# EAGLE schematic PETDOG-2 (EAGLE 7.5.0)
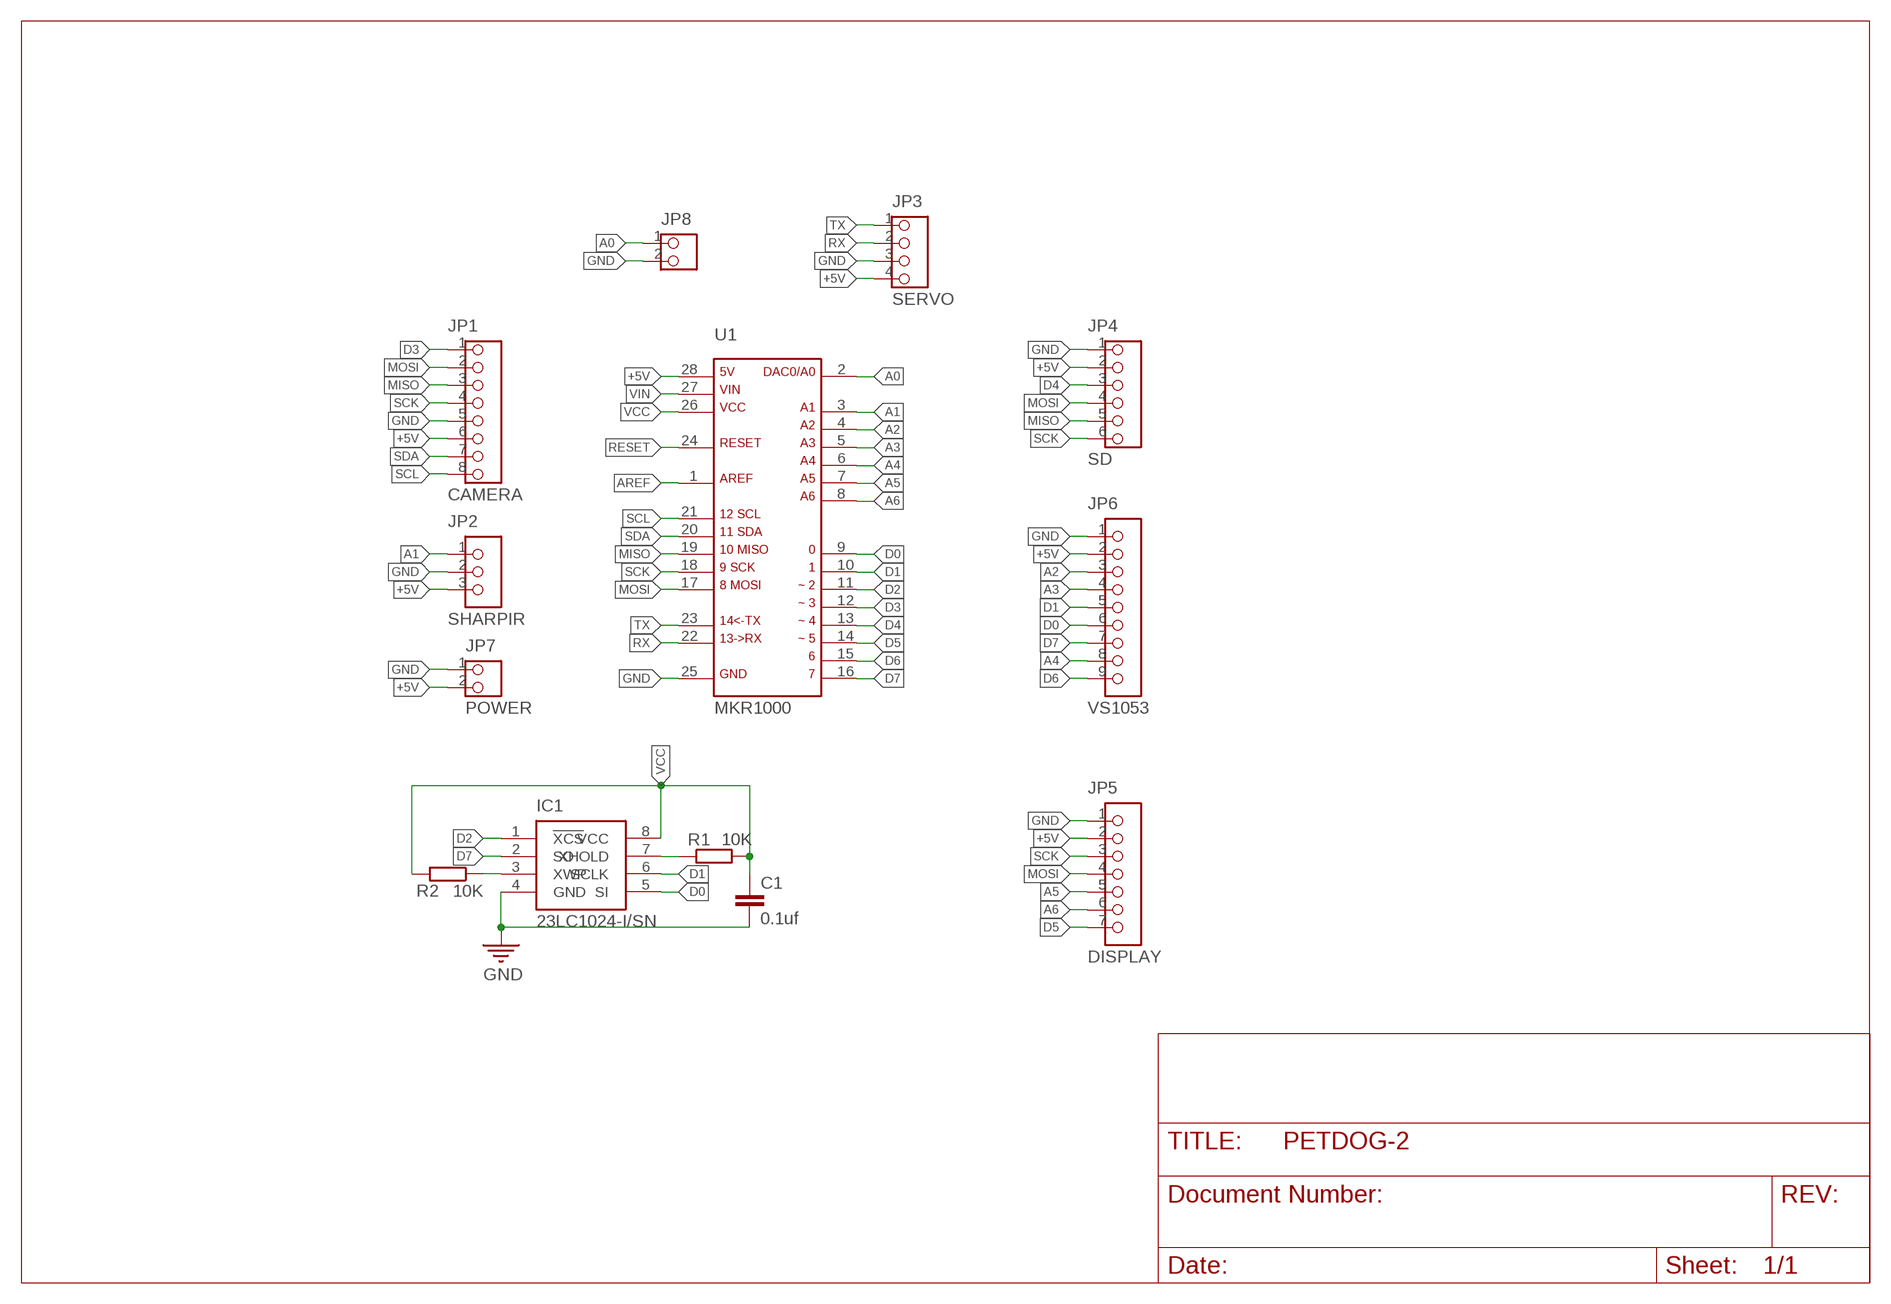
[diagram p0: schematic, sheet 1]

## Parts
C1  0.1uf  C-EUC0603  [C0603]
IC1  23LC1024-I/SN  VS23S010C-S  [VS23S010C-S]
JP1  CAMERA  PIN-1X8  [PIN-1X8]
JP2  SHARPIR  PIN-1X3  [PIN-1X3]
JP3  SERVO  PIN-1X4  [PIN-1X4]
JP4  SD  PIN-1X6  [PIN-1X6]
JP5  DISPLAY  PIN-1X7  [PIN-1X7]
JP6  VS1053  PIN-1X9  [PIN-1X9]
JP7  POWER  PIN-1X2  [PIN-1X2]
JP8  PAM8403  PIN-1X2  [PIN-1X2]
R1  10K  R-EU_R0603  [R0603]
R2  10K  R-EU_R0603  [R0603]
U1  MKR1000  MKR1000-2  [MKR1000-2]

## Nets
+5V [+5V]: JP1.6 JP2.3(AIN) JP3.4(GND) JP4.2($2) JP5.2 JP6.2 JP7.2 U1.28(5V)
A0: JP8.1 U1.2(DAC0/A0)
A1: JP2.1(GND) U1.3(A1)
A2: JP6.3 U1.4(A2)
A3: JP6.4 U1.5(A3)
A4: JP6.8 U1.6(A4)
A5: JP5.5 U1.7(A5)
A6: JP5.6 U1.8(A6)
AREF: U1.1(AREF)
D0: IC1.5(SI) JP6.6 U1.9
D1: IC1.6(SCLK) JP6.5 U1.10
D2: IC1.1(!XCS) U1.11(~2)
D3: JP1.1 U1.12(~3)
D4: JP4.3($3) U1.13(~4)
D5: JP5.7 U1.14(~5)
D6: JP6.9 U1.15
D7: IC1.2(SO) JP6.7 U1.16
GND [GND]: C1.2 IC1.4(GND) JP1.5 JP2.2(VCC) JP3.3(VCC) JP4.1($1) JP5.1 JP6.1 JP7.1 JP8.2 U1.25(GND)
MISO: JP1.3 JP4.5($5) U1.19(MISO)
MOSI: JP1.2 JP4.4($4) JP5.4 U1.17(MOSI)
N$1: IC1.7(XHOLD) R1.1
N$2: IC1.3(XWP) R2.1
RESET: U1.24(RESET)
RX: JP3.2(IO2) U1.22(RX)
SCK: JP1.4 JP4.6($6) JP5.3 U1.18(SCK)
SCL: JP1.8 U1.21(SCL)
SDA: JP1.7 U1.20(SDA)
TX: JP3.1(IO1) U1.23(TX)
VCC [VCC]: C1.1 IC1.8(VCC) R1.2 R2.2 U1.26(VCC)
VIN: U1.27(VIN)

## Library data of the parts
C1 = rcl:C-EU: CAPACITOR, European symbol
IC1 = R-10:VS23S010C-S
JP1 = R-10:PIN-1X8
JP2 = R-10:PIN-1X3
JP3 = R-10:PIN-1X4
JP4 = R-10:PIN-1X6
JP5 = R-10:PIN-1X7
JP6 = R-10:PIN-1X9
JP7 JP8 = R-10:PIN-1X2
R1 R2 = rcl:R-EU_: RESISTOR, European symbol
U1 = MKR1000:MKR1000-2

## Net classes
1 GND: width 1.016 mm, drill 0.711 mm
2 +5V: width 0.762 mm, drill 0.61 mm
3 VCC: width 0.635 mm, drill 0.559 mm
4 VIN: width 1.016 mm, drill 0.711 mm